# EAGLE design V1 (EAGLE 8.5.1)

## Sheet 1 of 4: Main MCU and crystal
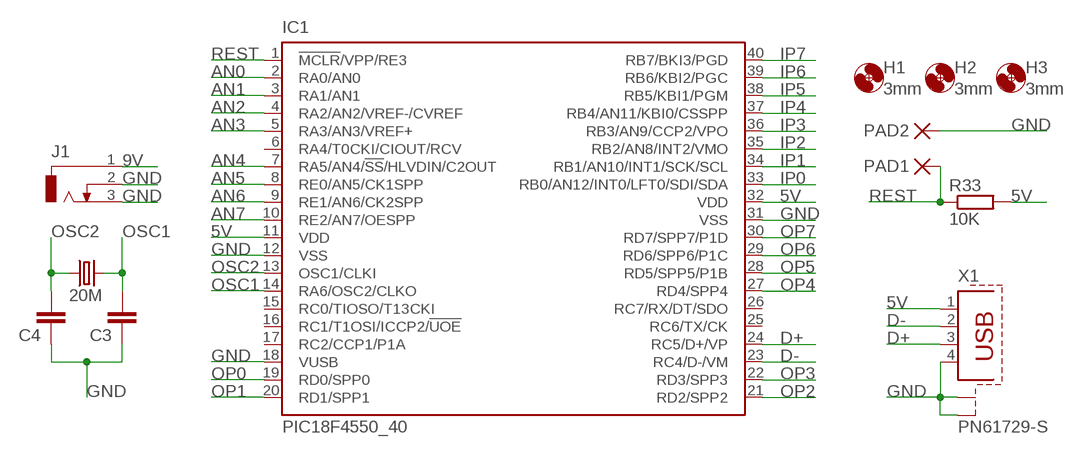
[diagram p0: schematic, sheet 1]

### Parts
20M  CRYSTALHC18U-V  [HC18U-V]
C3  C5/2.5  [C5B2.5]
C4  C5/2.5  [C5B2.5]
H1  3mm  MOUNT-HOLE3.0  [3,0]
H2  3mm  MOUNT-HOLE3.0  [3,0]
H3  3mm  MOUNT-HOLE3.0  [3,0]
IC1  PIC18F4550_40  [DIL40]
J1  DCJ0303  [DCJ0303]
PAD1  PAD-0320  [0320]
PAD2  PAD-0320  [0320]
R33  10K  R-EU_0207/10  [0207/10]
X1  PN61729-S  [PN61729-S]

### Nets
5V: IC1.11(VDD) IC1.32(VDD) R33.2 X1.1 ; also sheet 2
9V: J1.1 ; also sheet 4
AN0: IC1.2(RA0/AN0) ; also sheet 4
AN1: IC1.3(RA1/AN1) ; also sheet 4
AN2: IC1.4(RA2/AN2/VREF-/CVREF) ; also sheet 4
AN3: IC1.5(RA3/AN3/VREF+) ; also sheet 4
AN4: IC1.7(RA5/AN4/!SS!/HLVDIN/C2OUT) ; also sheet 4
AN5: IC1.8(RE0/AN5/CK1SPP) ; also sheet 4
AN6: IC1.9(RE1/AN6/CK2SPP) ; also sheet 4
AN7: IC1.10(RE2/AN7/OESPP) ; also sheet 4
D+: IC1.24(RC5/D+/VP) X1.3
D-: IC1.23(RC4/D-/VM) X1.2
GND: C3.1 C4.1 IC1.12(VSS) IC1.18(VUSB) IC1.31(VSS) J1.2 J1.3 PAD2.P$1(P) X1.4 X1.S1 X1.S2 ; also sheet 2,3,4
IP0: IC1.33(RB0/AN12/INT0/LFT0/SDI/SDA) ; also sheet 2
IP1: IC1.34(RB1/AN10/INT1/SCK/SCL) ; also sheet 2
IP2: IC1.35(RB2/AN8/INT2/VMO) ; also sheet 2
IP3: IC1.36(RB3/AN9/CCP2/VPO) ; also sheet 2
IP4: IC1.37(RB4/AN11/KBI0/CSSPP) ; also sheet 2
IP5: IC1.38(RB5/KBI1/PGM) ; also sheet 2
IP6: IC1.39(RB6/KBI2/PGC) ; also sheet 2
IP7: IC1.40(RB7/BKI3/PGD) ; also sheet 2
OP0: IC1.19(RD0/SPP0) ; also sheet 3
OP1: IC1.20(RD1/SPP1) ; also sheet 3
OP2: IC1.21(RD2/SPP2) ; also sheet 3
OP3: IC1.22(RD3/SPP3) ; also sheet 3
OP4: IC1.27(RD4/SPP4) ; also sheet 3
OP5: IC1.28(RD5/SPP5/P1B) ; also sheet 3
OP6: IC1.29(RD6/SPP6/P1C) ; also sheet 3
OP7: IC1.30(RD7/SPP7/P1D) ; also sheet 3
OSC1: 20M.2 C3.2 IC1.14(RA6/OSC2/CLKO)
OSC2: 20M.1 C4.2 IC1.13(OSC1/CLKI)
REST: IC1.1(!MCLR!/VPP/RE3) PAD1.P$1(P) R33.1
Unconnected: IC1.6(RA4/T0CKI/CIOUT/RCV) IC1.15(RC0/TIOSO/T13CKI) IC1.16(RC1/T1OSI/ICCP2/!UOE) IC1.17(RC2/CCP1/P1A) IC1.25(RC6/TX/CK) IC1.26(RC7/RX/DT/SDO)

## Sheet 2 of 4: Input Protection
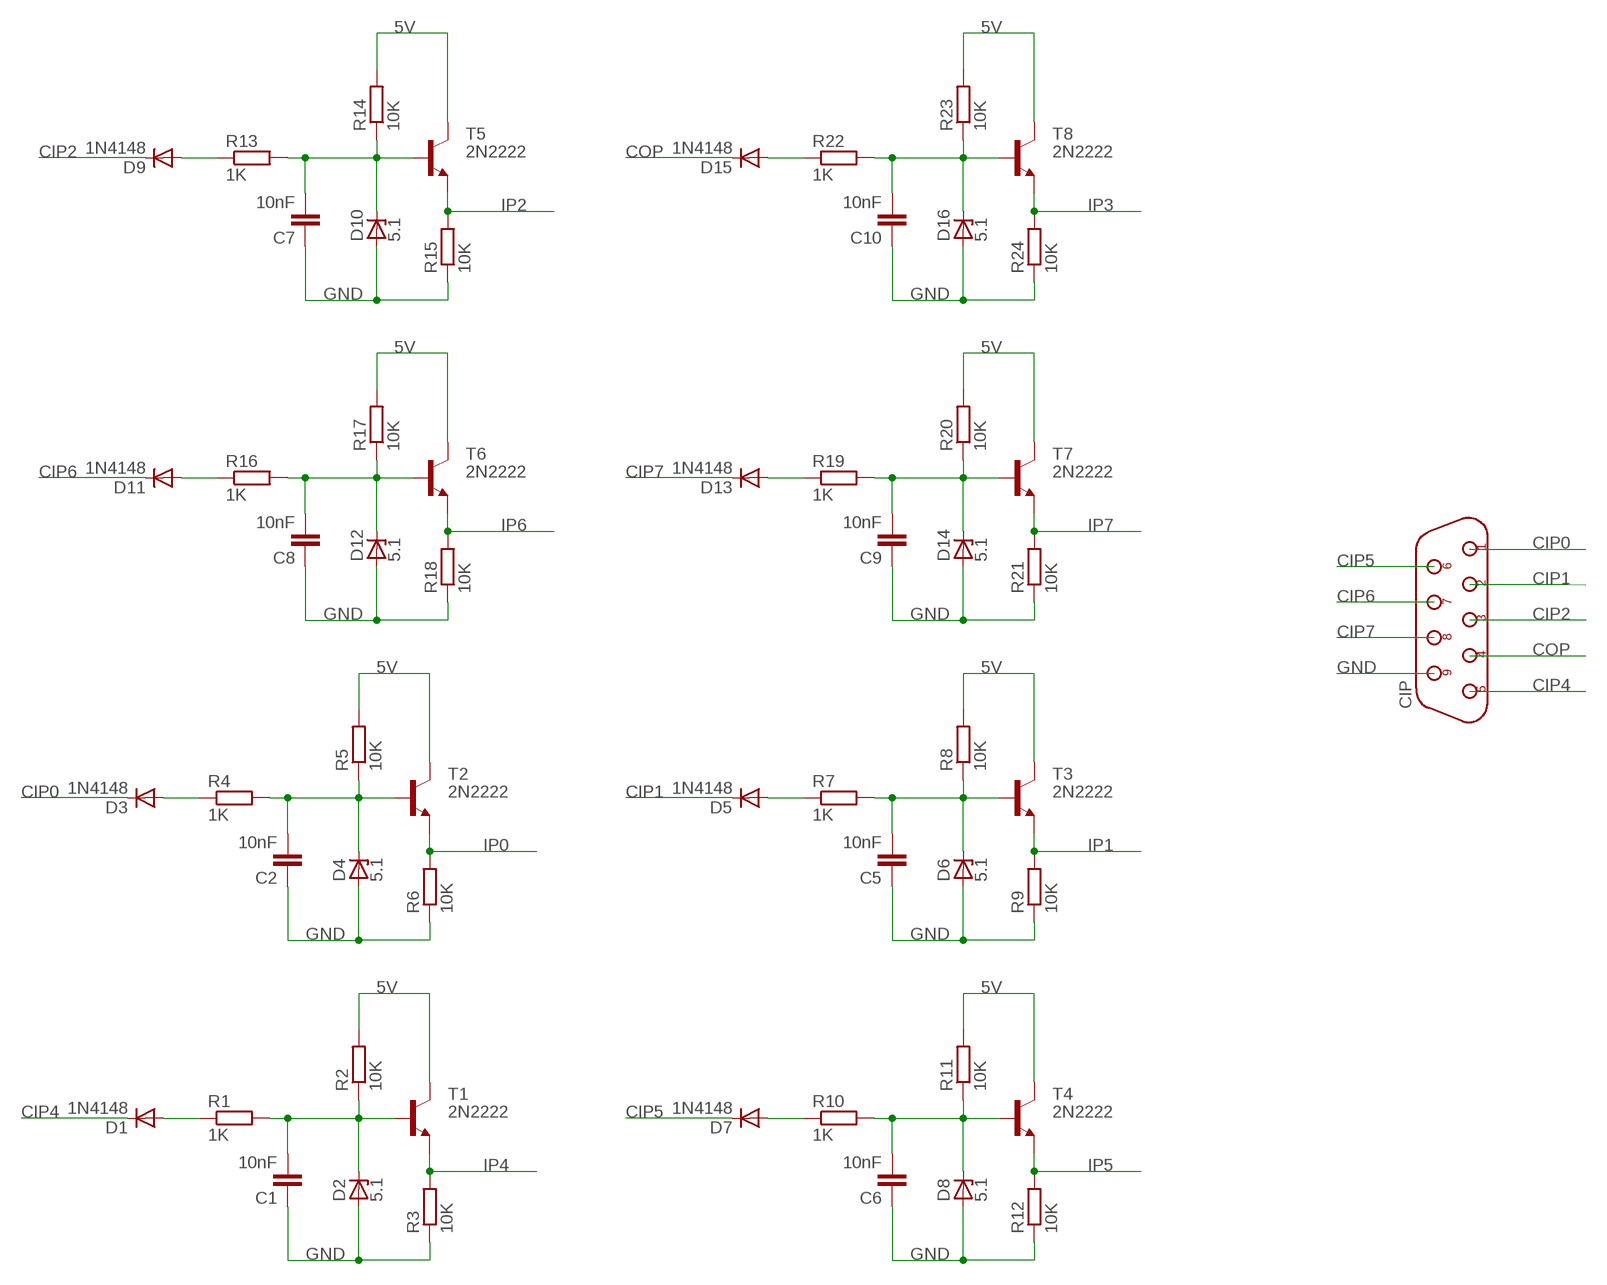
[diagram p1: schematic, sheet 2]

### Parts
C1  10nF  C5/2.5  [C5B2.5]
C2  10nF  C5/2.5  [C5B2.5]
C5  10nF  C5/2.5  [C5B2.5]
C6  10nF  C5/2.5  [C5B2.5]
C7  10nF  C5/2.5  [C5B2.5]
C8  10nF  C5/2.5  [C5B2.5]
C9  10nF  C5/2.5  [C5B2.5]
C10  10nF  C5/2.5  [C5B2.5]
CIP  DB9F/90  [D-09F/90]
D1  1N4148  [DO35-10]
D2  5.1  ZENER-DIODEZD-10  [ZDIO-10]
D3  1N4148  [DO35-10]
D4  5.1  ZENER-DIODEZD-10  [ZDIO-10]
D5  1N4148  [DO35-10]
D6  5.1  ZENER-DIODEZD-10  [ZDIO-10]
D7  1N4148  [DO35-10]
D8  5.1  ZENER-DIODEZD-10  [ZDIO-10]
D9  1N4148  [DO35-10]
D10  5.1  ZENER-DIODEZD-10  [ZDIO-10]
D11  1N4148  [DO35-10]
D12  5.1  ZENER-DIODEZD-10  [ZDIO-10]
D13  1N4148  [DO35-10]
D14  5.1  ZENER-DIODEZD-10  [ZDIO-10]
D15  1N4148  [DO35-10]
D16  5.1  ZENER-DIODEZD-10  [ZDIO-10]
R1  1K  R-EU_0207/10  [0207/10]
R2  10K  R-EU_0207/10  [0207/10]
R3  10K  R-EU_0207/10  [0207/10]
R4  1K  R-EU_0207/10  [0207/10]
R5  10K  R-EU_0207/10  [0207/10]
R6  10K  R-EU_0207/10  [0207/10]
R7  1K  R-EU_0207/10  [0207/10]
R8  10K  R-EU_0207/10  [0207/10]
R9  10K  R-EU_0207/10  [0207/10]
R10  1K  R-EU_0207/10  [0207/10]
R11  10K  R-EU_0207/10  [0207/10]
R12  10K  R-EU_0207/10  [0207/10]
R13  1K  R-EU_0207/10  [0207/10]
R14  10K  R-EU_0207/10  [0207/10]
R15  10K  R-EU_0207/10  [0207/10]
R16  1K  R-EU_0207/10  [0207/10]
R17  10K  R-EU_0207/10  [0207/10]
R18  10K  R-EU_0207/10  [0207/10]
R19  1K  R-EU_0207/10  [0207/10]
R20  10K  R-EU_0207/10  [0207/10]
R21  10K  R-EU_0207/10  [0207/10]
R22  1K  R-EU_0207/10  [0207/10]
R23  10K  R-EU_0207/10  [0207/10]
R24  10K  R-EU_0207/10  [0207/10]
T1  2N2222  [TO92-EBC-OVAL]
T2  2N2222  [TO92-EBC-OVAL]
T3  2N2222  [TO92-EBC-OVAL]
T4  2N2222  [TO92-EBC-OVAL]
T5  2N2222  [TO92-EBC-OVAL]
T6  2N2222  [TO92-EBC-OVAL]
T7  2N2222  [TO92-EBC-OVAL]
T8  2N2222  [TO92-EBC-OVAL]

### Nets
5V: R2.2 R5.2 R8.2 R11.2 R14.2 R17.2 R20.2 R23.2 T1.C T2.C T3.C T4.C T5.C T6.C T7.C T8.C ; also sheet 1
CIP0: CIP.1 D3.C
CIP1: CIP.2 D5.C
CIP2: CIP.3 D9.C
CIP4: CIP.5 D1.C
CIP5: CIP.6 D7.C
CIP6: CIP.7 D11.C
CIP7: CIP.8 D13.C
COP: CIP.4 D15.C
GND: C1.1 C2.1 C5.1 C6.1 C7.1 C8.1 C9.1 C10.1 CIP.9 D2.A D4.A D6.A D8.A D10.A D12.A D14.A D16.A R3.1 R6.1 R9.1 R12.1 R15.1 R18.1 R21.1 R24.1 ; also sheet 1,3,4
IP0: R6.2 T2.E ; also sheet 1
IP1: R9.2 T3.E ; also sheet 1
IP2: R15.2 T5.E ; also sheet 1
IP3: R24.2 T8.E ; also sheet 1
IP4: R3.2 T1.E ; also sheet 1
IP5: R12.2 T4.E ; also sheet 1
IP6: R18.2 T6.E ; also sheet 1
IP7: R21.2 T7.E ; also sheet 1
N$1: D1.A R1.1
N$2: C1.2 D2.C R1.2 R2.1 T1.B
N$3: D3.A R4.1
N$5: C2.2 D4.C R4.2 R5.1 T2.B
N$9: D5.A R7.1
N$10: C5.2 D6.C R7.2 R8.1 T3.B
N$13: D7.A R10.1
N$14: C6.2 D8.C R10.2 R11.1 T4.B
N$17: D9.A R13.1
N$18: C7.2 D10.C R13.2 R14.1 T5.B
N$21: D11.A R16.1
N$22: C8.2 D12.C R16.2 R17.1 T6.B
N$25: D13.A R19.1
N$26: C9.2 D14.C R19.2 R20.1 T7.B
N$29: D15.A R22.1
N$30: C10.2 D16.C R22.2 R23.1 T8.B

## Sheet 3 of 4: Output Protection
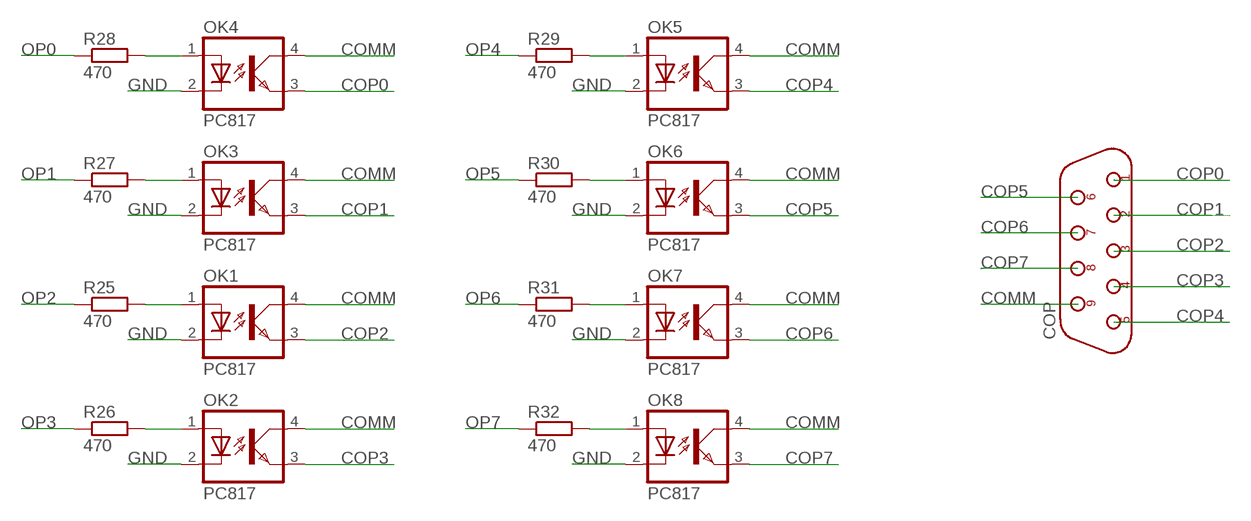
[diagram p2: schematic, sheet 3]

### Parts
COP  DB9F/90  [D-09F/90]
OK1  PC817  [DIL04]
OK2  PC817  [DIL04]
OK3  PC817  [DIL04]
OK4  PC817  [DIL04]
OK5  PC817  [DIL04]
OK6  PC817  [DIL04]
OK7  PC817  [DIL04]
OK8  PC817  [DIL04]
R25  470  R-EU_0207/10  [0207/10]
R26  470  R-EU_0207/10  [0207/10]
R27  470  R-EU_0207/10  [0207/10]
R28  470  R-EU_0207/10  [0207/10]
R29  470  R-EU_0207/10  [0207/10]
R30  470  R-EU_0207/10  [0207/10]
R31  470  R-EU_0207/10  [0207/10]
R32  470  R-EU_0207/10  [0207/10]

### Nets
COMM: COP.9 OK1.4(COL) OK2.4(COL) OK3.4(COL) OK4.4(COL) OK5.4(COL) OK6.4(COL) OK7.4(COL) OK8.4(COL)
COP0: COP.1 OK4.3(EMIT)
COP1: COP.2 OK3.3(EMIT)
COP2: COP.3 OK1.3(EMIT)
COP3: COP.4 OK2.3(EMIT)
COP4: COP.5 OK5.3(EMIT)
COP5: COP.6 OK6.3(EMIT)
COP6: COP.7 OK7.3(EMIT)
COP7: COP.8 OK8.3(EMIT)
GND: OK1.2(C) OK2.2(C) OK3.2(C) OK4.2(C) OK5.2(C) OK6.2(C) OK7.2(C) OK8.2(C) ; also sheet 1,2,4
N$4: OK1.1(A) R25.2
N$6: OK2.1(A) R26.2
N$15: OK3.1(A) R27.2
N$20: OK4.1(A) R28.2
N$27: OK5.1(A) R29.2
N$32: OK6.1(A) R30.2
N$35: OK7.1(A) R31.2
N$38: OK8.1(A) R32.2
OP0: R28.1 ; also sheet 1
OP1: R27.1 ; also sheet 1
OP2: R25.1 ; also sheet 1
OP3: R26.1 ; also sheet 1
OP4: R29.1 ; also sheet 1
OP5: R30.1 ; also sheet 1
OP6: R31.1 ; also sheet 1
OP7: R32.1 ; also sheet 1

## Sheet 4 of 4: Analog Protection
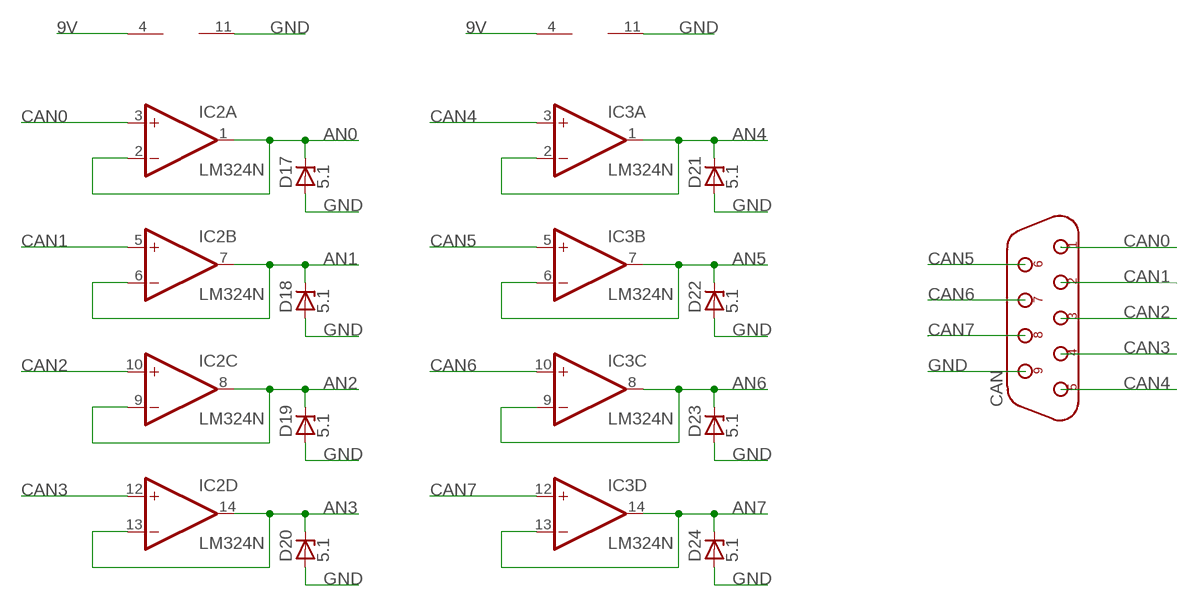
[diagram p3: schematic, sheet 4]

### Parts
CAN  DB9F/90  [D-09F/90]
D17  5.1  ZENER-DIODEZD-10  [ZDIO-10]
D18  5.1  ZENER-DIODEZD-10  [ZDIO-10]
D19  5.1  ZENER-DIODEZD-10  [ZDIO-10]
D20  5.1  ZENER-DIODEZD-10  [ZDIO-10]
D21  5.1  ZENER-DIODEZD-10  [ZDIO-10]
D22  5.1  ZENER-DIODEZD-10  [ZDIO-10]
D23  5.1  ZENER-DIODEZD-10  [ZDIO-10]
D24  5.1  ZENER-DIODEZD-10  [ZDIO-10]
IC2  LM324N  [DIL14]
IC3  LM324N  [DIL14]

### Nets
9V: IC2.4(P:V+) IC3.4(P:V+) ; also sheet 1
AN0: D17.C IC2.1(A:OUT) IC2.2(A:-IN) ; also sheet 1
AN1: D18.C IC2.6(B:-IN) IC2.7(B:OUT) ; also sheet 1
AN2: D19.C IC2.8(C:OUT) IC2.9(C:-IN) ; also sheet 1
AN3: D20.C IC2.13(D:-IN) IC2.14(D:OUT) ; also sheet 1
AN4: D21.C IC3.1(A:OUT) IC3.2(A:-IN) ; also sheet 1
AN5: D22.C IC3.6(B:-IN) IC3.7(B:OUT) ; also sheet 1
AN6: D23.C IC3.8(C:OUT) IC3.9(C:-IN) ; also sheet 1
AN7: D24.C IC3.13(D:-IN) IC3.14(D:OUT) ; also sheet 1
CAN0: CAN.1 IC2.3(A:+IN)
CAN1: CAN.2 IC2.5(B:+IN)
CAN2: CAN.3 IC2.10(C:+IN)
CAN3: CAN.4 IC2.12(D:+IN)
CAN4: CAN.5 IC3.3(A:+IN)
CAN5: CAN.6 IC3.5(B:+IN)
CAN6: CAN.7 IC3.10(C:+IN)
CAN7: CAN.8 IC3.12(D:+IN)
GND: CAN.9 D17.A D18.A D19.A D20.A D21.A D22.A D23.A D24.A IC2.11(P:V-) IC3.11(P:V-) ; also sheet 1,2,3

## Library data of the parts
20M = adafruit:CRYSTAL: CRYSTAL; OC_FARNELL: unknown; OC_NEWARK: unknown
C1-C10 = capacitor-wima:C: CAPACITOR naming: grid - package width
CAN CIP COP = connect:DB9F/90
D1 D3 D5 D7 D9 D11 D13 D15 = diode:1N4148: DIODE high speed (Philips)
D2 D4 D6 D8 D10 D12 D14 D16 = diode:ZENER-DIODE: Z-Diode
D17-D24 = diode-1:ZENER-DIODE: Z-Diode
H1-H3 = holes:MOUNT-HOLE: MOUNTING HOLE with drill center marker
IC1 = microchip:PIC18F4*_40: USB Microcontrollers with nanoWatt Technology High-Performance, Enhanced Flash, 28/40/44-Pin, Source: http://ww1.microchip.com/downloads/en/devicedoc/39632c.pdf; MF: MICROCHIP; MPN: PIC18F4550-I/P; OC_FARNELL: 9321357; OC_NEWARK: 74K8623
IC2 IC3 = linear:LM324: OP AMP
J1 = con-jack:DCJ0303: DC POWER JACK Source: DCJ0303.pdf; OC_FARNELL: unknown; OC_NEWARK: unknown
OK1-OK8 = optocoupler:PC817: SHARP OPTO COUPLER; MPN: PC817X4J000F; OC_FARNELL: 9707727; OC_NEWARK: 97K7059
PAD1 PAD2 = dpads:PAD: WIRE PAD Standard US Drill Sizes and SMD pads
R1-R33 = rcl:R-EU_: RESISTOR, European symbol
T1-T8 = adafruit:2N2222: NPN TRANSISTOR Big oval pads
X1 = con-berg:PN61729-S: BERG USB connector; OC_FARNELL: unknown; OC_NEWARK: unknown

## Board
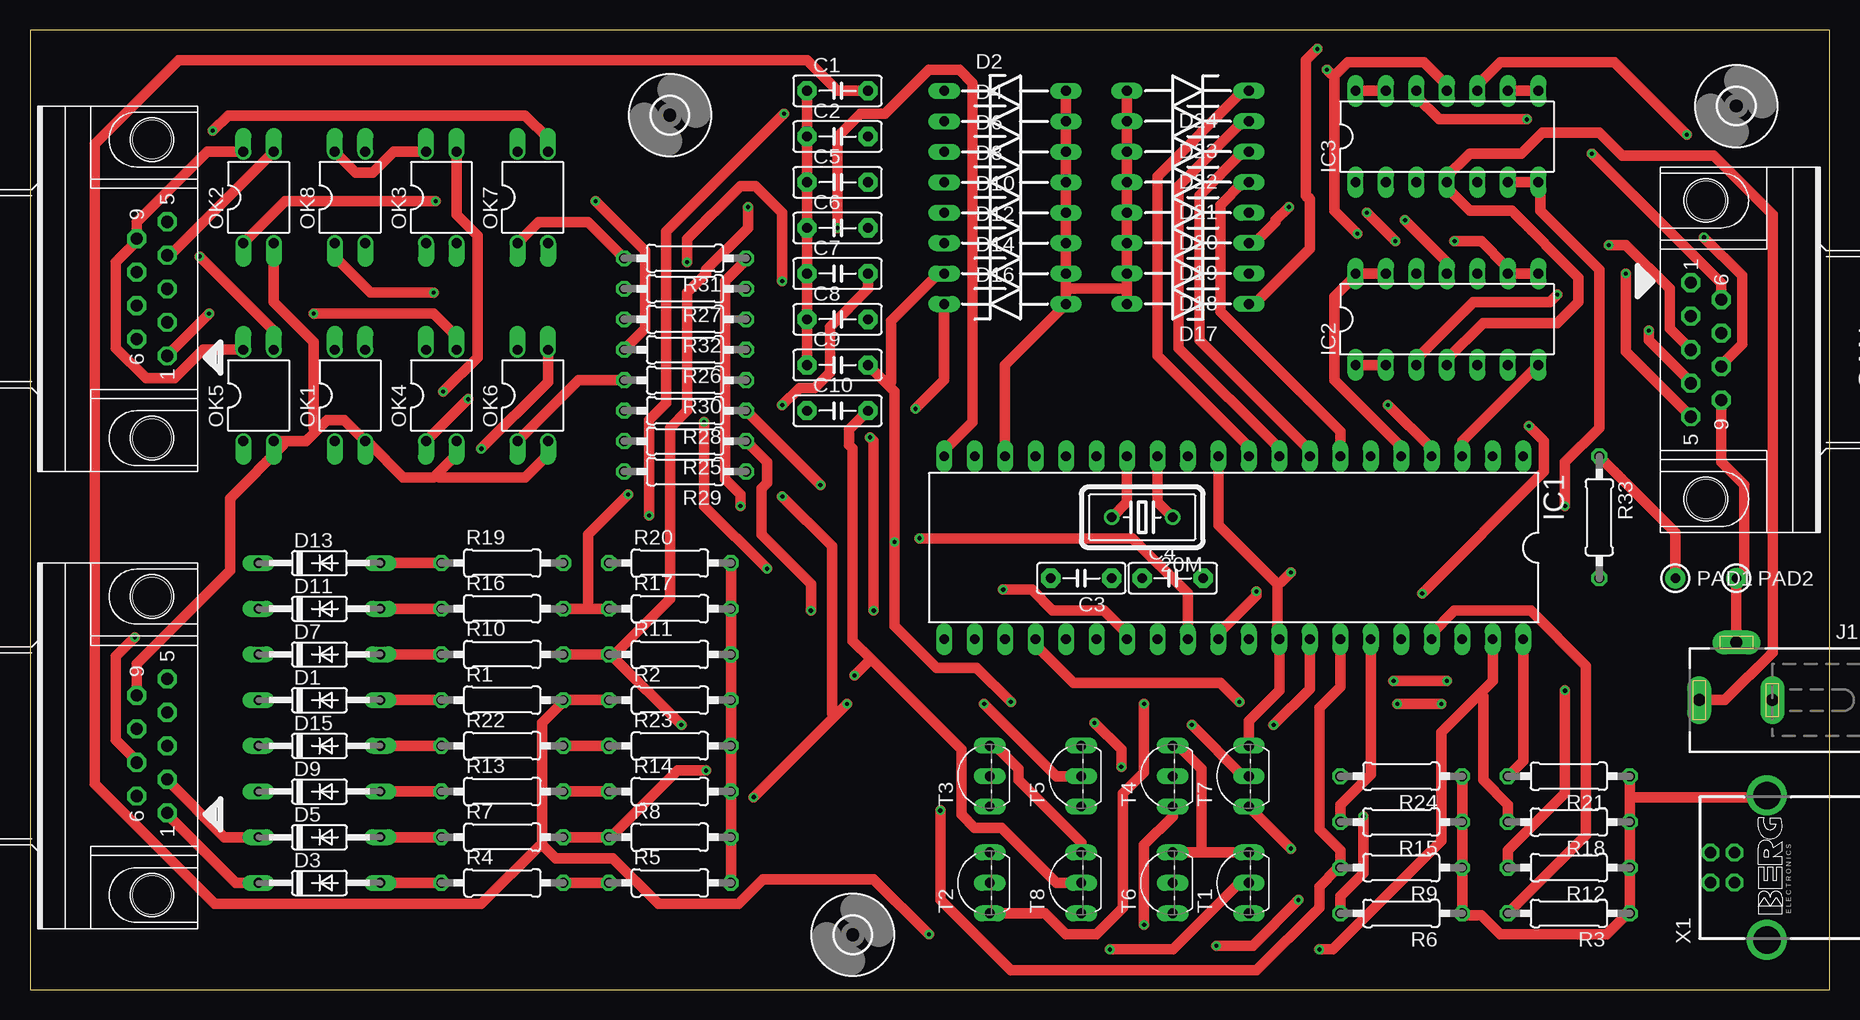
[diagram p4: board, top side]
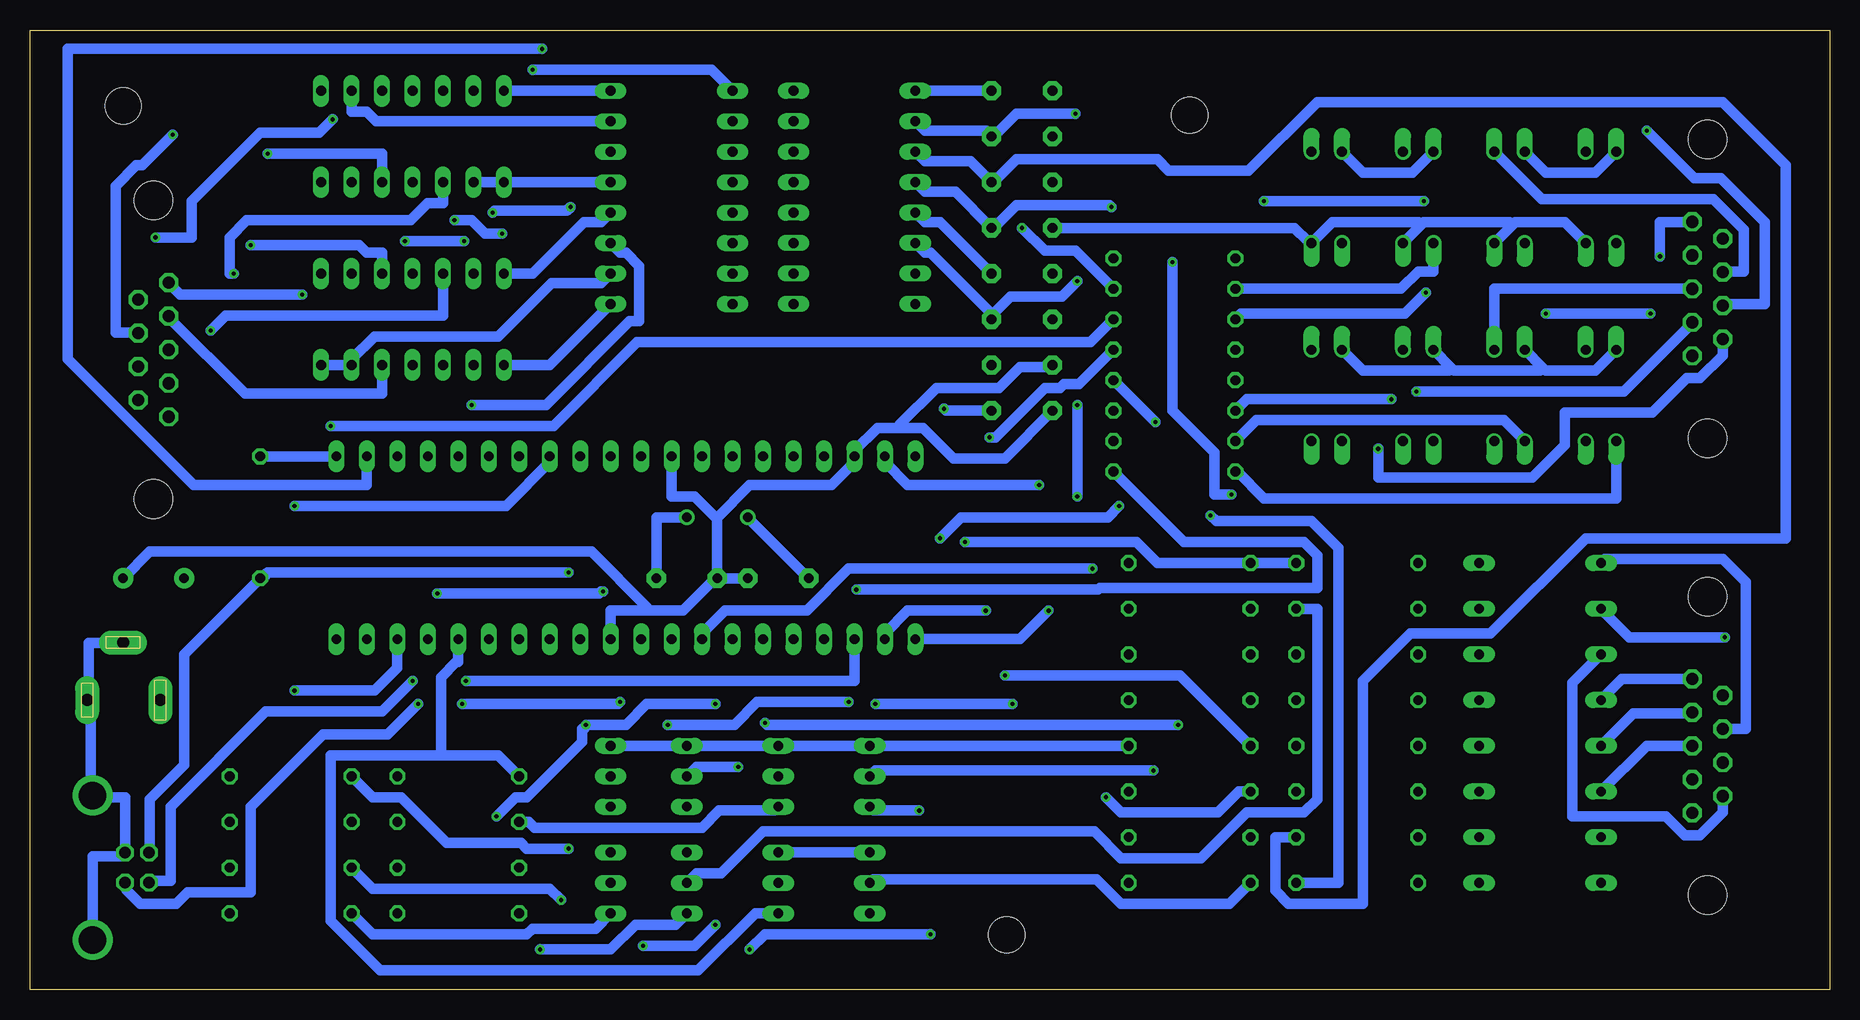
[diagram p5: board, bottom side, seen from below]

Size 150 x 80 mm. Coordinates in mm from the lower left corner, seen from the top.
Outline: 0,0 150,0 150,80 0,80 0,0
Copper layers (1*16): Top 0.035mm / dielectric 1.5mm / Bottom 0.035mm
Design rules "default *": minimum track width 35mil, minimum drill 0.35mm, track to track 30mil, track to pad 20mil, pad to pad 6mil, via to via 40mil, smd to smd 6mil, copper to edge 40mil, drill to drill 6mil, minimum pad ring 10mil, minimum via ring 8mil, stop-mask expansion 4mil, vias tented up to drill 0mil, thermal gap 10mil

### Footprints (pad centres in the part's own frame; a part is rotated, then mirrored left to right if it is on the bottom)
HC18U-V = drill 0.813: 1 -2.54,0; 2 2.54,0
C5B2.5 = drill 0.813 pad 1.6 octagon: 1 -2.54,0; 2 2.54,0
D-09F/90 = drill 1.016 pad 1.575 octagon: 1 -5.588,-1.27; 2 -2.794,-1.27; 3 0,-1.27; 4 2.794,-1.27; 5 5.588,-1.27; 6 -4.191,1.27; 7 -1.397,1.27; 8 1.397,1.27; 9 4.191,1.27 | hole 3.2: 12.446,0; -12.446,0
DO35-10 = drill 0.813 long: A 5.08,0; C -5.08,0
ZDIO-10 = drill 0.813 long: A 5.08,0; C -5.08,0
3,0 = hole 3: 0,0
DIL40 = drill 0.813 long: 1 -24.13,-7.62; 2 -21.59,-7.62; 3 -19.05,-7.62; 4 -16.51,-7.62; 5 -13.97,-7.62; 6 -11.43,-7.62; 7 -8.89,-7.62; 8 -6.35,-7.62; 9 -3.81,-7.62; 10 -1.27,-7.62; 11 1.27,-7.62; 12 3.81,-7.62; 13 6.35,-7.62; 14 8.89,-7.62; 15 11.43,-7.62; 16 13.97,-7.62; 17 16.51,-7.62; 18 19.05,-7.62; 19 21.59,-7.62; 20 24.13,-7.62; 21 24.13,7.62; 22 21.59,7.62; 23 19.05,7.62; 24 16.51,7.62; 25 13.97,7.62; 26 11.43,7.62; 27 8.89,7.62; 28 6.35,7.62; 29 3.81,7.62; 30 1.27,7.62; 31 -1.27,7.62; 32 -3.81,7.62; 33 -6.35,7.62; 34 -8.89,7.62; 35 -11.43,7.62; 36 -13.97,7.62; 37 -16.51,7.62; 38 -19.05,7.62; 39 -21.59,7.62; 40 -24.13,7.62
DIL14 = drill 0.813 long: 1 -7.62,-3.81; 2 -5.08,-3.81; 3 -2.54,-3.81; 4 0,-3.81; 5 2.54,-3.81; 6 5.08,-3.81; 7 7.62,-3.81; 8 7.62,3.81; 9 5.08,3.81; 10 2.54,3.81; 11 0,3.81; 12 -2.54,3.81; 13 -5.08,3.81; 14 -7.62,3.81
DCJ0303 = drill 1 pad 2 long: 1 0,3.1; 2 4.8,0; 3 0,-3
DIL04 = drill 0.813 offset: 1 -1.27,-3.81; 2 1.27,-3.81; 3 1.27,3.81; 4 -1.27,3.81
0320 = drill 0.813 pad 1.676: P$1 0,0
0207/10 = drill 0.813 octagon: 1 -5.08,0; 2 5.08,0
TO92-EBC-OVAL = drill 0.813 long: B 0,-1.27; C 2.54,-1.27; E -2.54,-1.27
PN61729-S = drill 0.95 octagon: 1 1.25,4.71; 2 -1.25,4.71; 3 -1.25,2.71; 4 1.25,2.71 | drill 2.3 pad 2.9: S1 -6.02,0; S2 6.02,0

### Placement (x,y rotation side)
20M  92.71,39.37 180 top
C1  67.31,74.93 0 top
C2  67.31,71.12 0 top
C3  87.63,34.29 180 top
C4  95.25,34.29 0 top
C5  67.31,67.31 0 top
C6  67.31,63.5 0 top
C7  67.31,59.69 0 top
C8  67.31,55.88 0 top
C9  67.31,52.07 0 top
C10  67.31,48.26 0 top
CAN  139.7,53.34 270 top
CIP  10.16,20.32 90 top
COP  10.16,58.42 90 top
D1  24.13,24.13 0 top
D2  81.28,74.93 0 top
D3  24.13,8.89 0 top
D4  81.28,72.39 0 top
D5  24.13,12.7 0 top
D6  81.28,69.85 0 top
D7  24.13,27.94 0 top
D8  81.28,67.31 0 top
D9  24.13,16.51 0 top
D10  81.28,64.77 0 top
D11  24.13,31.75 0 top
D12  81.28,62.23 0 top
D13  24.13,35.56 0 top
D14  81.28,59.69 0 top
D15  24.13,20.32 0 top
D16  81.28,57.15 0 top
D17  96.52,57.15 180 top
D18  96.52,59.69 180 top
D19  96.52,62.23 180 top
D20  96.52,64.77 180 top
D21  96.52,67.31 180 top
D22  96.52,69.85 180 top
D23  96.52,72.39 180 top
D24  96.52,74.93 180 top
H1  68.58,4.57 0 top
H2  53.34,72.9 0 top
H3  142.24,73.66 0 top
IC1  100.33,36.83 180 top
IC2  118.11,55.88 0 top
IC3  118.11,71.12 0 top
J1  142.24,24.13 90 top
OK1  26.67,49.53 0 top
OK2  19.05,66.04 0 top
OK3  34.29,66.04 0 top
OK4  34.29,49.53 0 top
OK5  19.05,49.53 0 top
OK6  41.91,49.53 0 top
OK7  41.91,66.04 0 top
OK8  26.67,66.04 0 top
PAD1  137.16,34.29 0 top
PAD2  142.24,34.29 0 top
R1  39.37,24.13 0 top
R2  53.34,24.13 0 top
R3  128.27,6.35 180 top
R4  39.37,8.89 0 top
R5  53.34,8.89 0 top
R6  114.3,6.35 180 top
R7  39.37,12.7 0 top
R8  53.34,12.7 0 top
R9  114.3,10.16 180 top
R10  39.37,27.94 0 top
R11  53.34,27.94 0 top
R12  128.27,10.16 180 top
R13  39.37,16.51 0 top
R14  53.34,16.51 0 top
R15  114.3,13.97 180 top
R16  39.37,31.75 0 top
R17  53.34,31.75 0 top
R18  128.27,13.97 180 top
R19  39.37,35.56 0 top
R20  53.34,35.56 0 top
R21  128.27,17.78 180 top
R22  39.37,20.32 0 top
R23  53.34,20.32 0 top
R24  114.3,17.78 180 top
R25  54.61,45.72 180 top
R26  54.61,53.34 180 top
R27  54.61,58.42 180 top
R28  54.61,48.26 180 top
R29  54.61,43.18 180 top
R30  54.61,50.8 180 top
R31  54.61,60.96 180 top
R32  54.61,55.88 180 top
R33  130.81,39.37 270 top
T1  100.33,8.89 90 top
T2  78.74,8.89 90 top
T3  78.74,17.78 90 top
T4  93.98,17.78 90 top
T5  86.36,17.78 90 top
T6  93.98,8.89 90 top
T7  100.33,17.78 90 top
T8  86.36,8.89 90 top
X1  144.78,10.16 90 top

### Tracks (layer width: path | path; a pad name or v marks a point on that pad's centre or on a via)
5V  (via drill 0.35)
  Top 0.889: R5.2 R8.2 R14.2 R23.2 R2.2 R11.2 R17.2 R20.2 | T8.C 87.63,12.22 82.39,17.46 82.39,18.41 80.49,20.32 T3.C | T1.C 97.63,11.43 | 97.63,11.43 T6.C | T7.C 101.6,22.38 104.14,24.92 IC1.32 103.98,29.53 103.98,33.81 | IC1.11 99.06,38.73 103.98,33.81 | 97.63,11.43 97.63,18.41 95.73,20.32 T4.C | v105.09,34.77 104.3,33.97 103.98,33.81
  Bottom 0.889: X1.1 140.02,11.43 140.02,15.88 137.16,18.73 137.16,27.94 R33.2 130.49,34.45 130.18,34.77 v105.09,34.77 | T8.C T2.C | T7.C T4.C T5.C T3.C R23.2
9V
  Top 0.889: IC2.4 118.11,52.55 121.13,55.56 127.32,55.56 129.06,57.31 129.06,59.37 123.51,64.93 120.02,64.93 118.11,66.83 IC3.4 117.95,67.63 120.02,69.69 124.3,69.69 126.05,71.44 130.81,71.44 132.72,69.53 140.34,69.53 145.26,64.61 145.26,28.1 141.29,24.13 J1.1
AN0  (via drill 0.35)
  Top 0.889: IC2.2 IC2.1 | v107.31,78.42 106.36,77.47 106.36,66.2 106.68,65.88 106.68,61.75 102.08,57.15 D17.C
  Bottom 0.889: D17.C 106.68,52.07 IC2.1 | IC1.2 121.92,42.07 136.37,42.07 146.84,52.55 146.84,78.42 v107.31,78.42
AN1
  Top 0.889: IC1.3 119.38,45.72 IC2.7
  Bottom 0.889: D18.C 102.39,58.9 106.52,58.9 110.97,54.45 121.28,54.45 123.19,52.55 IC2.6 IC2.7
AN2  (via drill 0.35)
  Top 0.889: IC2.8 IC2.9 123.03,60.01 123.03,60.33 120.97,62.39 v118.75,62.39 | v113.19,48.74 116.84,45.09 IC1.4 | v111.44,64.77 v113.82,62.39 | v104.93,65.25 103.82,64.14 103.82,63.98 102.08,62.23 D19.C
  Bottom 0.889: D19.C 100.81,61.44 100.33,61.44 99.22,60.33 99.22,55.72 100.01,55.72 107,48.74 v113.19,48.74 | v113.82,62.39 v118.75,62.39 | v111.44,64.77 111.28,64.93 105.25,64.93 v104.93,65.25
AN3
  Top 0.889: IC2.13 IC2.14 110.33,59.37 108.74,57.78 108.74,50.8 114.3,45.24 IC1.5
  Bottom 0.889: D20.C 102.39,63.98 103.82,63.98 108.11,59.69 IC2.14
AN4
  Top 0.889: IC1.7 109.22,46.51 99.22,56.52 99.22,65.41 101.12,67.31 D21.C
  Bottom 0.889: D21.C IC3.1 IC3.2
AN5  (via drill 0.35)
  Top 0.889: IC3.6 IC3.7 125.89,66.99 125.89,64.93 130.81,60.01 130.81,46.83 127.95,43.97 v127.95,40.32 | D22.C 101.12,69.85 97.47,66.2 97.47,54.13 106.68,44.93 IC1.8
  Bottom 0.889: v127.95,40.32 110.33,40.32 106.68,43.97 IC1.8
AN6
  Top 0.889: IC3.8 IC3.9 | IC1.9 104.14,45.09 95.73,53.5 95.73,66.99 101.12,72.39 D23.C
  Bottom 0.889: IC3.9 123.19,73.18 121.92,73.18 121.13,72.39 D23.C
AN7
  Top 0.889: IC3.13 IC3.14 | IC1.10 101.6,45.24 93.98,52.86 93.98,67.79 101.12,74.93 D24.C
  Bottom 0.889: D24.C IC3.14
CAN0  (via drill 0.35)
  Top 0.889: IC2.3 115.57,52.55 120.33,57.31 126.68,57.31 v127.32,57.94
  Bottom 0.889: v127.32,57.94 137.48,57.94 138.43,58.9 CAN.1
CAN1
  Bottom 0.889: IC2.5 120.65,49.69 132.08,49.69 138.43,56.04 CAN.2
CAN2  (via drill 0.35)
  Top 0.889: v131.6,62.07 133.03,62.07 136.68,58.42 136.68,55.09 CAN.3
  Bottom 0.889: IC2.10 120.65,61.44 121.92,61.44 122.56,62.07 v131.6,62.07
CAN3  (via drill 0.35)
  Top 0.889: v134.94,54.93 134.94,54.13 138.43,50.64 CAN.4
  Bottom 0.889: IC2.12 115.57,56.2 133.67,56.2 v134.94,54.93
CAN4  (via drill 0.35)
  Top 0.889: v133.03,59.69 133.03,53.18 138.43,47.78 CAN.5
  Bottom 0.889: IC3.3 115.57,65.56 116.84,65.56 118.27,64.14 131.92,64.14 133.35,62.71 133.35,59.69 v133.03,59.69
CAN5  (via drill 0.35)
  Top 0.889: v130.18,69.69 140.97,58.9 CAN.6
  Bottom 0.889: IC3.5 120.65,69.69 v130.18,69.69
CAN6  (via drill 0.35)
  Top 0.889: IC3.10 120.65,75.41 122.56,77.31 132.08,77.31 v138.11,71.28
  Bottom 0.889: v138.11,71.28 140.65,68.74 141.13,68.74 142.88,66.99 142.88,54.77 140.97,54.77 CAN.7
CAN7  (via drill 0.35)
  Top 0.889: IC3.12 115.57,74.45 117.47,72.55 v124.78,72.55 | v139.54,62.71 142.72,59.53 142.72,53.82 140.97,52.07 CAN.8
  Bottom 0.889: v124.78,72.55 125.89,71.44 130.81,71.44 136.53,65.72 136.53,62.71 v139.54,62.71
CIP0
  Top 0.889: D3.C 17.14,8.89 11.43,14.61 CIP.1
CIP1
  Top 0.889: D5.C 16.19,12.7 11.43,17.46 CIP.2
CIP2
  Bottom 0.889: D9.C 15.24,20.32 CIP.3
CIP4
  Bottom 0.889: D1.C 17.3,25.88 11.43,25.88 CIP.5
CIP5
  Bottom 0.889: D7.C 21.43,25.56 21.43,14.45 13.65,14.45 12.06,12.86 10.79,12.86 8.89,14.76 CIP.6
CIP6  (via drill 0.35)
  Top 0.889: v8.73,29.37 7.14,27.78 7.14,20.8 8.89,19.05 CIP.7
  Bottom 0.889: D11.C 16.67,29.37 v8.73,29.37
CIP7
  Bottom 0.889: D13.C 18.73,35.88 8.89,35.88 6.99,33.97 6.99,21.75 8.89,21.75 CIP.8
COMM
  Top 0.889: OK2.4 14.76,69.85 8.89,63.98 COP.9 8.73,62.23 7.14,60.64 7.14,53.5 9.68,50.96 12.06,50.96 14.45,53.34 OK5.4 | OK3.4 30.32,69.85 28.57,68.1 27.15,68.1 OK8.4
  Bottom 0.889: OK5.4 19.53,51.59 23.65,51.59 23.89,51.83 | OK1.4 23.89,51.83 | 31.51,51.83 31.27,51.59 24.13,51.59 23.89,51.83 | 31.51,51.83 OK4.4 | OK6.4 38.89,51.59 31.75,51.59 31.51,51.83 | OK3.4 34.77,68.1 38.89,68.1 OK7.4 | OK2.4 19.53,68.1 23.65,68.1 OK8.4
COP
  Bottom 0.889: D15.C 16.35,23.02 11.43,23.02 CIP.4
COP0  (via drill 0.35)
  Top 0.889: OK4.3 35.56,54.45 33.66,56.36 v23.65,56.36 | v14.92,56.36 11.43,52.86 COP.1
  Bottom 0.889: v14.92,56.36 v23.65,56.36
COP1  (via drill 0.35)
  Top 0.889: OK3.3 35.56,64.61 37.31,62.87 37.31,52.7 v34.45,49.85
  Bottom 0.889: v34.45,49.85 17.14,49.85 11.43,55.56 COP.2
COP2
  Bottom 0.889: OK1.3 27.94,58.42 COP.3
COP3
  Top 0.889: OK2.3 11.75,61.28 11.43,61.28 COP.4
COP4  (via drill 0.35)
  Top 0.889: OK5.3 20.32,54.93 v14.13,61.12
  Bottom 0.889: v14.13,61.12 14.13,63.98 11.43,63.98 COP.5
COP5  (via drill 0.35)
  Top 0.889: OK6.3 43.18,50.64 v37.62,45.09
  Bottom 0.889: v37.62,45.09 37.62,42.7 24.77,42.7 22.07,45.4 22.07,48.1 14.76,48.1 11.91,50.96 10.79,50.96 8.89,52.86 COP.6
COP6  (via drill 0.35)
  Top 0.889: OK7.3 43.18,70.96 41.27,72.87 16.51,72.87 v15.24,71.6
  Bottom 0.889: v15.24,71.6 11.27,67.63 9.05,67.63 5.4,63.98 5.4,57.15 8.89,57.15 COP.7
COP7
  Bottom 0.889: OK8.3 23.97,65.88 9.68,65.88 7.14,63.34 7.14,59.85 8.89,59.85 COP.8
D+  (via drill 0.35)
  Top 0.889: IC1.24 83.82,28.73 87,25.56 99.22,25.56 v100.81,23.97 | v117.63,23.81 v113.98,23.81
  Bottom 0.889: v100.81,23.97 100.97,23.81 v113.98,23.81 | v117.63,23.81 120.17,21.27 125.57,21.27 131.6,15.24 131.6,8.1 136.84,8.1 137.79,7.14 140.81,7.14 141.92,8.26 141.92,8.89 X1.3
D-  (via drill 0.35)
  Top 0.889: v118.11,25.72 v113.67,25.72
  Bottom 0.889: IC1.23 81.28,25.72 v113.67,25.72 | v118.11,25.72 120.65,23.18 130.33,23.18 138.27,15.24 138.27,9.05 140.02,9.05 X1.2
GND  (via drill 0.35)
  Top 0.889: R24.1 R15.1 R9.1 R6.1 119.7,6.19 120.97,6.19 122.56,4.6 131.44,4.6 133.03,6.19 R3.1 R12.1 R18.1 133.35,16.03 | 133.35,16.03 R21.1 | CAN.9 140.97,43.97 142.88,42.07 142.88,34.92 PAD2.P$1 J1.2 | 133.35,16.03 144.78,16.03 X1.S2 | 21.11,45.72 23.02,45.72 23.89,46.59 | 21.11,45.72 OK5.2 | 23.89,46.59 24.77,47.47 26.19,47.47 OK1.2 28.26,45.56 31.11,42.7 33.66,42.7 33.89,42.94 | OK4.2 35.56,44.61 33.89,42.94 | OK6.2 43.18,44.61 41.27,42.7 34.13,42.7 33.89,42.94 | CIP.9 8.89,27.15 16.67,34.92 16.67,40.96 21.11,45.4 21.11,45.72 | OK2.2 20.32,57.31 23.65,53.98 23.65,46.83 23.89,46.59 | C9.1 C8.1 C7.1 C6.1 C5.1 C2.1 C1.1 | IC2.11 118.11,60.64 v114.62,64.14 | v110.65,63.02 108.74,64.93 108.74,76.2 | 108.74,76.2 109.86,77.31 116.2,77.31 118.11,75.41 IC3.11 | 91.44,58.42 D18.A D19.A D20.A D21.A D22.A D23.A D24.A | 91.44,58.42 D17.A | IC1.18 81.28,52.07 D16.A 86.36,58.42 | 86.36,58.42 D14.A D12.A D10.A D8.A D6.A D4.A D2.A | 86.36,58.42 91.44,58.42 | v108.11,76.68 108.43,76.36 108.74,76.2
  Bottom 0.889: X1.S1 144.78,11.11 142.4,11.11 X1.4 142.08,11.43 142.08,16.03 144.78,16.03 X1.S2 144.94,16.51 144.94,23.81 J1.3 145.1,24.13 145.1,28.89 142.24,28.89 J1.2 | OK2.2 22.07,63.98 26.19,63.98 26.43,63.74 | OK8.2 26.43,63.74 | 34.05,63.74 33.81,63.98 26.67,63.98 26.43,63.74 | 34.05,63.74 OK3.2 | 34.05,63.74 34.29,63.98 41.43,63.98 OK7.2 43.5,62.39 44.61,63.5 C6.1 | IC1.12 96.52,41.12 94.61,41.12 92.79,39.29 | 92.79,39.29 92.71,39.21 C4.1 | IC1.31 101.6,31.59 98.58,31.59 | 98.58,31.59 95.57,31.59 93.03,34.13 C4.1 | C4.1 C3.1 | v114.62,64.14 113.19,64.14 112.08,63.02 v110.65,63.02 | C10.1 68.74,44.29 73.03,44.29 75.56,46.83 77.47,46.83 | 77.47,46.83 79.38,46.83 81.28,44.93 IC1.18 81.12,44.13 83.19,42.07 90.01,42.07 92.79,39.29 | v108.11,76.68 93.19,76.68 D24.A | C9.1 64.93,51.91 67.47,51.91 69.22,50.16 74.45,50.16 77.47,47.15 77.47,46.83 | PAD2.P$1 140.02,36.51 103.19,36.51 98.58,31.91 98.58,31.59
IP0  (via drill 0.35)
  Top 0.889: T2.E 84.61,6.35 86.36,4.6 88.9,4.6 91.12,6.83 91.12,16.35 92.87,18.1 v92.87,23.81 | v103.66,22.07 106.68,25.08 IC1.33 | R6.2 109.22,7.78 111.12,9.68 v111.12,14.45
  Bottom 0.889: v92.87,23.81 98.58,23.81 100.33,22.07 v103.66,22.07 103.82,21.75 103.98,21.75 103.98,20.64 108.58,16.03 109.54,16.03 v111.12,14.45
IP1  (via drill 0.35)
  Top 0.889: IC1.34 109.22,25.24 107.47,23.5 107.47,13.34 109.22,11.59 R9.2 108.9,10 107.47,8.57 107.47,6.83 102.23,1.59 81.76,1.59 75.88,7.46 v75.88,14.92
  Bottom 0.889: T3.E 79.69,14.92 v75.88,14.92
IP2
  Top 0.889: R15.2 109.22,15.4 111.76,17.94 IC1.35
  Bottom 0.889: T5.E 87.95,14.92 92.55,14.92 93.98,13.49 107.95,13.49 108.43,13.97 R15.2
IP3
  Bottom 0.889: T8.E 89.53,6.35 94.3,1.59 120.81,1.59 124.94,5.71 124.94,19.53 115.73,19.53 | 115.73,19.53 110.97,19.53 R24.2 | IC1.36 114.3,27.3 114.46,27.3 115.73,26.04 115.73,19.53
IP4
  Top 0.889: IC1.37 116.84,29.69 118.75,31.59 125.09,31.59 129.7,26.99 129.7,12.86 R3.2
  Bottom 0.889: T1.E 102.87,5.08 108.11,5.08 108.58,4.6 121.44,4.6 R3.2
IP5  (via drill 0.35)
  Top 0.889: R12.2 123.19,11.59 127.95,16.35 v127.95,24.92 | T4.E 95.25,14.45 92.87,12.06 v92.87,5.4 | v98.9,3.65 101.92,3.65 v105.73,7.46
  Bottom 0.889: v127.95,24.92 121.28,24.92 119.38,26.83 IC1.38 | v92.87,5.4 94.61,3.65 v98.9,3.65 | v105.73,7.46 106.68,8.41 121.44,8.41 R12.2
IP6  (via drill 0.35)
  Top 0.889: v107.47,3.33 108.58,3.33 117.63,12.38 117.63,21.43 120.89,24.69 | 120.89,24.69 121.92,25.72 IC1.39 | R18.2 123.19,15.4 121.13,17.46 121.13,24.45 120.89,24.69
  Bottom 0.889: T6.E 96.2,5.4 99.54,5.4 101.6,3.33 v107.47,3.33
IP7  (via drill 0.35)
  Top 0.889: v105.09,11.75 T7.E | IC1.40 124.46,19.05 R21.2
  Bottom 0.889: v105.09,11.75 108.58,11.75 109.06,12.22 115.25,12.22 119.06,16.03 121.44,16.03 R21.2
N$1
  Top 0.889: R1.1 D1.A
N$2  (via drill 0.35)
  Top 0.889: R2.1 R1.2 44.29,23.81 42.7,22.23 42.7,12.06 | T1.B 100.81,8.89 95.25,3.33 v90.01,3.33 | v74.93,4.6 70.33,9.21 61.12,9.21 59.05,7.14 52.39,7.14 48.58,10.95 43.81,10.95 42.7,12.06 | C1.2 67.31,74.93 64.77,77.47 12.38,77.47 5.4,70.48 5.4,17.14 15.4,7.14 37.62,7.14 42.39,11.91 42.7,12.06
  Bottom 0.889: C1.2 D2.C | v90.01,3.33 88.74,4.6 v74.93,4.6
N$3
  Top 0.889: R4.1 D3.A
N$4
  Bottom 0.889: OK1.1 27.15,47.47 47.78,47.47 R25.2
N$5  (via drill 0.35)
  Top 0.889: R5.1 R4.2 | v62.87,73.03 53.02,63.18 53.02,48.9 51.59,47.47 v51.59,39.53
  Bottom 0.889: D4.C 75.41,71.6 70.33,71.6 C2.2 69.53,71.28 67.79,73.03 v62.87,73.03 | T2.B 79.69,9.21 61.12,9.21 59.05,7.14 50.01,7.14 R5.1 | v51.59,39.53 51.12,39.05 43.18,39.05 40.96,36.83 40.96,8.89 R4.2
N$6  (via drill 0.35)
  Top 0.889: OK2.1 21.27,65.72 v33.81,65.72 | v47.15,65.72 51.28,61.59 51.28,55.09 R26.2
  Bottom 0.889: v47.15,65.72 v33.81,65.72
N$9
  Top 0.889: R7.1 D5.A
N$10  (via drill 0.35)
  Top 0.889: R7.2 R8.1 48.58,12.86 53.98,18.26 v56.36,18.26
  Bottom 0.889: D6.C 75.41,69.06 71.6,69.06 C5.2 69.53,67.47 67.79,69.22 56.04,69.22 55.09,68.26 48.42,68.26 42.7,73.98 8.89,73.98 3.65,68.74 3.65,37.62 20.32,37.62 28.26,29.69 34.92,29.69 38.89,25.72 38.89,7.14 45.09,7.14 46.2,8.26 46.2,12.7 R7.2 | T3.B 79.53,18.26 v56.36,18.26
N$13
  Top 0.889: R10.1 D7.A
N$14  (via drill 0.35)
  Top 0.889: R11.1 R10.2 | v90.96,18.57 90.96,20 v88.74,22.23 | v54.29,22.07 48.58,27.78 R11.1 | v59.85,65.25 59.85,63.5 56.36,60.01 56.36,59.69 54.77,58.1 54.77,48.26 53.34,46.83 53.34,32.54 48.9,28.1 R11.1
  Bottom 0.889: D8.C 75.41,66.52 72.87,66.52 C6.2 69.53,63.66 67.79,65.41 60.01,65.41 v59.85,65.25 | T4.B 94.46,18.57 v90.96,18.57 | v88.74,22.23 88.58,22.07 v54.29,22.07
N$15
  Bottom 0.889: OK3.1 33.02,59.85 34.29,59.85 35.72,58.42 R27.2
N$17
  Top 0.889: R13.1 D9.A
N$18  (via drill 0.35)
  Top 0.889: R14.1 R13.2 | T5.B 85.57,17.78 v79.53,23.81 | v60.33,16.03 67.07,22.78 | 67.07,22.78 v68.1,23.81 | C7.2 69.85,58.42 66.67,55.24 66.67,51.44 65.41,50.16 64.14,50.16 v62.71,48.74 | v62.71,41.12 66.83,36.99 66.83,23.02 67.07,22.78
  Bottom 0.889: D10.C 75.41,63.98 74.14,63.98 C7.2 | v68.1,23.81 v79.53,23.81 | v60.33,16.03 59.05,14.76 50.96,14.76 49.21,16.51 R14.1 | v62.71,41.12 v62.71,48.74
N$20  (via drill 0.35)
  Top 0.889: v36.51,49.21 OK4.1
  Bottom 0.889: v36.51,49.21 48.58,49.21 R28.2
N$21
  Top 0.889: R16.1 D11.A
N$22  (via drill 0.35)
  Top 0.889: R17.1 46.51,31.75 | 46.51,31.75 R16.2 | v62.71,59.05 62.71,64.77 60.48,66.99 59.21,66.99 54.77,62.55 v54.77,60.64 | v49.85,41.27 46.51,37.94 46.51,31.75
  Bottom 0.889: D12.C 75.41,61.44 74.93,61.44 69.85,56.36 C8.2 69.53,56.52 68.26,57.78 63.98,57.78 v62.71,59.05 | T6.B 94.46,9.68 92.39,9.68 88.9,13.18 61.28,13.18 59.05,10.95 52.39,10.95 48.58,14.76 43.81,14.76 42.7,15.88 42.7,31.75 R16.2 | v54.77,60.64 54.77,48.26 51.28,44.77 51.28,41.27 v49.85,41.27
N$25
  Top 0.889: R19.1 D13.A
N$26  (via drill 0.35)
  Top 0.889: T7.B 101.12,17.78 v96.84,22.07 | v81.76,23.97 78.9,26.83 75.56,26.83 72.07,30.32 v72.07,37.31 72.07,49.85 71.52,50.4 | C9.2 71.52,50.4 | D14.C 75.72,59.69 71.75,55.72 71.75,50.64 71.52,50.4
  Bottom 0.889: R19.2 R20.1 56.04,35.56 57.78,37.31 v72.07,37.31 | v96.84,22.07 91.28,22.07 89.38,23.97 v81.76,23.97
N$27
  Bottom 0.889: OK5.1 17.78,40.96 47.15,40.96 49.37,43.18 R29.2
N$29
  Top 0.889: R22.1 D15.A
N$30  (via drill 0.35)
  Top 0.889: R23.1 R22.2 | D16.C 76.2,50.8 v73.82,48.42 | T8.B 85.57,8.89 80.96,13.49 78.74,13.49 77.63,14.61 77.63,20 70.09,27.54 | 70.09,27.54 68.58,29.05 68.58,45.09 68.26,45.4 68.26,46.67 C10.2 | 70.09,27.54 v68.74,26.19
  Bottom 0.889: v73.82,48.42 73.66,48.26 C10.2 | R23.1 54.13,26.19 v68.74,26.19
N$32
  Top 0.889: OK6.1 45.72,50.8 R30.2
N$35
  Top 0.889: OK7.1 42.39,63.98 46.51,63.98 R31.2
N$38  (via drill 0.35)
  Top 0.889: OK8.1 25.4,61.12 28.42,58.1 v33.66,58.1
  Bottom 0.889: v33.66,58.1 35.4,56.36 49.05,56.36 R32.2
OP0  (via drill 0.35)
  Top 0.889: v65.88,42.07 R28.1
  Bottom 0.889: v65.88,42.07 76.83,42.07 78.74,43.97 IC1.19
OP1  (via drill 0.35)
  Top 0.889: v67.31,63.5 67.31,71.12 69.22,73.03 71.28,73.03 74.93,76.68 77.47,76.68 78.58,75.56 78.58,47.31 76.2,44.93 IC1.20
  Bottom 0.889: R27.1 62.87,61.59 65.41,61.59 v67.31,63.5
OP2  (via drill 0.35)
  Top 0.889: R25.1 61.44,43.97 61.44,42.23 60.96,41.75 60.96,37.94 65.09,33.81 v65.09,31.59
  Bottom 0.889: v65.09,31.59 67.47,29.21 IC1.21
OP3  (via drill 0.35)
  Top 0.889: v70.01,46.04 70.33,45.72 v70.33,31.59
  Bottom 0.889: R26.1 62.55,50.48 63.82,50.48 64.14,50.16 65.41,50.16 69.53,46.04 v70.01,46.04 | v70.33,31.59 76.83,31.59 78.74,29.69 IC1.22
OP4  (via drill 0.35)
  Top 0.889: v81.12,33.34 83.5,33.34 85.25,31.59 89.53,31.59 91.44,29.69 IC1.27
  Bottom 0.889: R29.1 53.82,37.31 43.81,37.31 42.7,36.2 42.7,33.5 60.8,33.5 60.96,33.34 v81.12,33.34
OP5  (via drill 0.35)
  Top 0.889: v56.2,47.31 56.2,40.32 v61.44,35.08
  Bottom 0.889: v56.2,47.31 R30.1 | v61.44,35.08 81.76,35.08 85.25,31.59 92.08,31.59 93.98,29.69 IC1.28
OP6  (via drill 0.35)
  Top 0.889: IC1.29 96.52,33.02 91.92,37.62 v74.14,37.62 | v59.21,40.32 59.21,41.27 57.94,42.55 57.94,59.05 59.69,60.8 R31.1
  Bottom 0.889: v74.14,37.62 72.39,39.37 60.17,39.37 v59.21,40.32
OP7  (via drill 0.35)
  Top 0.889: v124.94,46.99 126.21,45.72 126.21,43.18 v116.05,33.02 | v102.23,33.18 102.23,32.86 99.06,29.69 IC1.30
  Bottom 0.889: R32.1 61.59,53.98 99.38,53.98 106.36,46.99 v124.94,46.99 | v116.05,33.02 102.55,33.02 102.39,33.18 v102.23,33.18
OSC1
  Top 0.889: IC1.14 91.44,40.64 20M.2
  Bottom 0.889: C3.2 20M.2
OSC2
  Top 0.889: IC1.13 93.98,40.64 20M.1
  Bottom 0.889: C4.2 97.79,39.37 20M.1
REST
  Top 0.889: PAD1.P$1 137.16,38.1 R33.1
  Bottom 0.889: R33.1 IC1.1